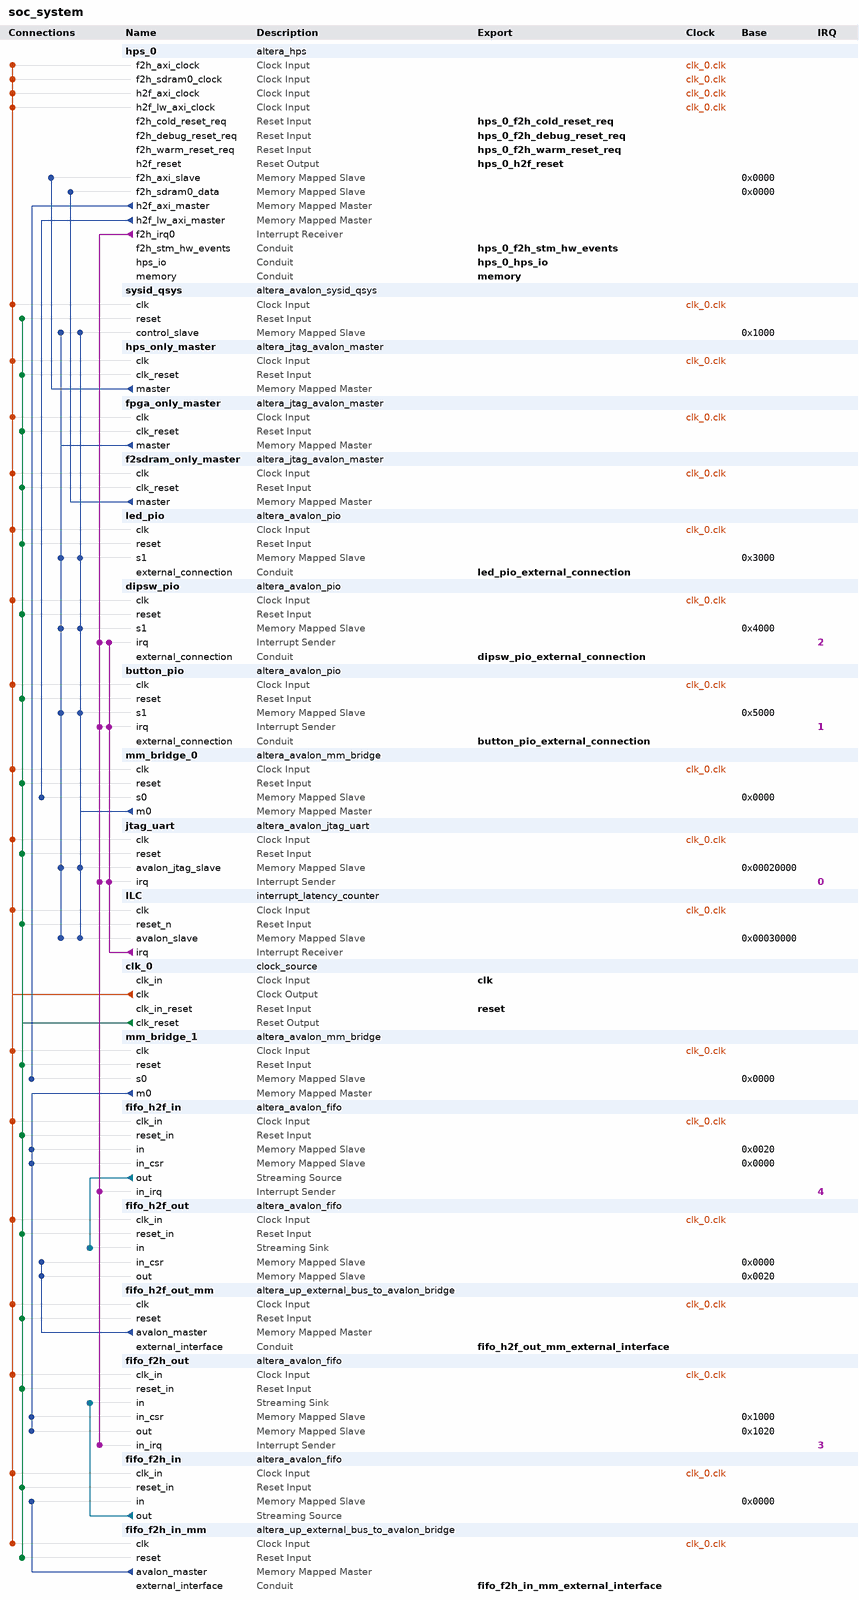
[diagram p0: system contents]
# Platform Designer (Qsys) system soc_system, Cyclone V 5CSXFC6D6F31C6
# Parameters at their usual value, and those the tool derives, are not listed.
package require -exact qsys 18.1
create_system soc_system
set_project_property DEVICE_FAMILY {Cyclone V}
set_project_property DEVICE 5CSXFC6D6F31C6

add_instance hps_0 altera_hps 18.1
set_instance_parameter_value hps_0 EMAC1_Mode RGMII
set_instance_parameter_value hps_0 EMAC1_PinMuxing {HPS I/O Set 0}
set_instance_parameter_value hps_0 F2SCLK_COLDRST_Enable true
set_instance_parameter_value hps_0 F2SCLK_DBGRST_Enable true
set_instance_parameter_value hps_0 F2SCLK_WARMRST_Enable true
set_instance_parameter_value hps_0 F2SDRAM_Type {Avalon-MM Bidirectional}
set_instance_parameter_value hps_0 F2SDRAM_Width 256
set_instance_parameter_value hps_0 F2SINTERRUPT_Enable true
set_instance_parameter_value hps_0 F2S_Width 2
set_instance_parameter_value hps_0 FPGA_PERIPHERAL_OUTPUT_CLOCK_FREQ_EMAC0_GTX_CLK 100
set_instance_parameter_value hps_0 FPGA_PERIPHERAL_OUTPUT_CLOCK_FREQ_EMAC0_MD_CLK 100.0
set_instance_parameter_value hps_0 FPGA_PERIPHERAL_OUTPUT_CLOCK_FREQ_EMAC1_GTX_CLK 100
set_instance_parameter_value hps_0 FPGA_PERIPHERAL_OUTPUT_CLOCK_FREQ_EMAC1_MD_CLK 100.0
set_instance_parameter_value hps_0 HPS_PROTOCOL DDR3
set_instance_parameter_value hps_0 I2C0_Mode I2C
set_instance_parameter_value hps_0 I2C0_PinMuxing {HPS I/O Set 0}
set_instance_parameter_value hps_0 I2C1_Mode I2C
set_instance_parameter_value hps_0 I2C1_PinMuxing {HPS I/O Set 0}
set_instance_parameter_value hps_0 LWH2F_Enable true
set_instance_parameter_value hps_0 MEM_BANKADDR_WIDTH 3
set_instance_parameter_value hps_0 MEM_CLK_FREQ 400.0
set_instance_parameter_value hps_0 MEM_COL_ADDR_WIDTH 10
set_instance_parameter_value hps_0 MEM_DQ_WIDTH 32
set_instance_parameter_value hps_0 MEM_DRV_STR RZQ/6
set_instance_parameter_value hps_0 MEM_ROW_ADDR_WIDTH 15
set_instance_parameter_value hps_0 MEM_RTT_NOM RZQ/6
set_instance_parameter_value hps_0 MEM_RTT_WR {Dynamic ODT off}
set_instance_parameter_value hps_0 MEM_TCL 11
set_instance_parameter_value hps_0 MEM_TFAW_NS 45.0
set_instance_parameter_value hps_0 MEM_TRAS_NS 35.0
set_instance_parameter_value hps_0 MEM_TRCD_NS 13.75
set_instance_parameter_value hps_0 MEM_TRFC_NS 260.0
set_instance_parameter_value hps_0 MEM_TRP_NS 13.75
set_instance_parameter_value hps_0 MEM_VENDOR Micron
set_instance_parameter_value hps_0 MEM_WTCL 7
set_instance_parameter_value hps_0 QSPI_Mode {1 SS}
set_instance_parameter_value hps_0 QSPI_PinMuxing {HPS I/O Set 0}
set_instance_parameter_value hps_0 REF_CLK_FREQ 25.0
set_instance_parameter_value hps_0 S2FCLK_USER2CLK 5
set_instance_parameter_value hps_0 S2F_Width 2
set_instance_parameter_value hps_0 SDIO_Mode {4-bit Data}
set_instance_parameter_value hps_0 SDIO_PinMuxing {HPS I/O Set 0}
set_instance_parameter_value hps_0 SPIM0_Mode {Single Slave Select}
set_instance_parameter_value hps_0 SPIM0_PinMuxing {HPS I/O Set 0}
set_instance_parameter_value hps_0 SPIM1_Mode {Single Slave Select}
set_instance_parameter_value hps_0 SPIM1_PinMuxing {HPS I/O Set 0}
set_instance_parameter_value hps_0 STM_Enable true
set_instance_parameter_value hps_0 TIMING_BOARD_AC_SKEW 0.02
set_instance_parameter_value hps_0 TIMING_BOARD_AC_TO_CK_SKEW 0.01
set_instance_parameter_value hps_0 TIMING_BOARD_DQ_TO_DQS_SKEW 0.05
set_instance_parameter_value hps_0 TIMING_BOARD_MAX_CK_DELAY 0.03
set_instance_parameter_value hps_0 TIMING_BOARD_MAX_DQS_DELAY 0.02
set_instance_parameter_value hps_0 TIMING_BOARD_SKEW_BETWEEN_DQS 0.06
set_instance_parameter_value hps_0 TIMING_BOARD_SKEW_CKDQS_DIMM_MAX 0.12
set_instance_parameter_value hps_0 TIMING_BOARD_SKEW_CKDQS_DIMM_MIN 0.06
set_instance_parameter_value hps_0 TIMING_BOARD_SKEW_WITHIN_DQS 0.01
set_instance_parameter_value hps_0 TIMING_TDH 65
set_instance_parameter_value hps_0 TIMING_TDQSCK 255
set_instance_parameter_value hps_0 TIMING_TDQSQ 125
set_instance_parameter_value hps_0 TIMING_TDS 30
set_instance_parameter_value hps_0 TIMING_TIH 140
set_instance_parameter_value hps_0 TIMING_TIS 190
set_instance_parameter_value hps_0 TIMING_TQSH 0.4
set_instance_parameter_value hps_0 UART0_Mode {No Flow Control}
set_instance_parameter_value hps_0 UART0_PinMuxing {HPS I/O Set 0}
set_instance_parameter_value hps_0 USB1_Mode SDR
set_instance_parameter_value hps_0 USB1_PinMuxing {HPS I/O Set 0}
set_instance_parameter_value hps_0 desired_cfg_clk_mhz 100.0
set_instance_parameter_value hps_0 desired_qspi_clk_mhz 400.0

add_instance sysid_qsys altera_avalon_sysid_qsys 18.1
set_instance_parameter_value sysid_qsys id -1395322110

add_instance hps_only_master altera_jtag_avalon_master 18.1

add_instance fpga_only_master altera_jtag_avalon_master 18.1

add_instance f2sdram_only_master altera_jtag_avalon_master 18.1

add_instance led_pio altera_avalon_pio 18.1
set_instance_parameter_value led_pio direction Output
set_instance_parameter_value led_pio width 10

add_instance dipsw_pio altera_avalon_pio 18.1
set_instance_parameter_value dipsw_pio bitClearingEdgeCapReg true
set_instance_parameter_value dipsw_pio captureEdge true
set_instance_parameter_value dipsw_pio direction Input
set_instance_parameter_value dipsw_pio edgeType ANY
set_instance_parameter_value dipsw_pio generateIRQ true
set_instance_parameter_value dipsw_pio irqType EDGE
set_instance_parameter_value dipsw_pio width 10

add_instance button_pio altera_avalon_pio 18.1
set_instance_parameter_value button_pio bitClearingEdgeCapReg true
set_instance_parameter_value button_pio captureEdge true
set_instance_parameter_value button_pio direction Input
set_instance_parameter_value button_pio edgeType FALLING
set_instance_parameter_value button_pio generateIRQ true
set_instance_parameter_value button_pio irqType EDGE
set_instance_parameter_value button_pio width 4

add_instance mm_bridge_0 altera_avalon_mm_bridge 18.1
set_instance_parameter_value mm_bridge_0 ADDRESS_UNITS SYMBOLS
set_instance_parameter_value mm_bridge_0 ADDRESS_WIDTH 10
set_instance_parameter_value mm_bridge_0 DATA_WIDTH 32
set_instance_parameter_value mm_bridge_0 MAX_PENDING_RESPONSES 4
set_instance_parameter_value mm_bridge_0 USE_AUTO_ADDRESS_WIDTH 1

add_instance jtag_uart altera_avalon_jtag_uart 18.1
set_instance_parameter_value jtag_uart allowMultipleConnections true
set_instance_parameter_value jtag_uart simInteractiveOptions INTERACTIVE_ASCII_OUTPUT

add_instance ILC interrupt_latency_counter 18.1

add_instance clk_0 clock_source 18.1
set_instance_parameter_value clk_0 clockFrequency 50000000

add_instance mm_bridge_1 altera_avalon_mm_bridge 18.1
set_instance_parameter_value mm_bridge_1 ADDRESS_UNITS SYMBOLS
set_instance_parameter_value mm_bridge_1 ADDRESS_WIDTH 10
set_instance_parameter_value mm_bridge_1 DATA_WIDTH 32
set_instance_parameter_value mm_bridge_1 MAX_PENDING_RESPONSES 4
set_instance_parameter_value mm_bridge_1 USE_AUTO_ADDRESS_WIDTH 1

add_instance fifo_h2f_in altera_avalon_fifo 18.1
set_instance_parameter_value fifo_h2f_in bitsPerSymbol 8
set_instance_parameter_value fifo_h2f_in channelWidth 0
set_instance_parameter_value fifo_h2f_in errorWidth 0
set_instance_parameter_value fifo_h2f_in fifoDepth 512
set_instance_parameter_value fifo_h2f_in fifoInputInterfaceOptions AVALONMM_WRITE
set_instance_parameter_value fifo_h2f_in fifoOutputInterfaceOptions AVALONST_SOURCE
set_instance_parameter_value fifo_h2f_in singleClockMode true
set_instance_parameter_value fifo_h2f_in symbolsPerBeat 4
set_instance_parameter_value fifo_h2f_in useIRQ true
set_instance_parameter_value fifo_h2f_in usePacket true
set_instance_parameter_value fifo_h2f_in useReadControl false

add_instance fifo_h2f_out altera_avalon_fifo 18.1
set_instance_parameter_value fifo_h2f_out bitsPerSymbol 8
set_instance_parameter_value fifo_h2f_out channelWidth 0
set_instance_parameter_value fifo_h2f_out errorWidth 0
set_instance_parameter_value fifo_h2f_out fifoDepth 8
set_instance_parameter_value fifo_h2f_out fifoInputInterfaceOptions AVALONST_SINK
set_instance_parameter_value fifo_h2f_out fifoOutputInterfaceOptions AVALONMM_READ
set_instance_parameter_value fifo_h2f_out singleClockMode true
set_instance_parameter_value fifo_h2f_out symbolsPerBeat 4
set_instance_parameter_value fifo_h2f_out useIRQ false
set_instance_parameter_value fifo_h2f_out usePacket true
set_instance_parameter_value fifo_h2f_out useReadControl false

add_instance fifo_h2f_out_mm altera_up_external_bus_to_avalon_bridge 18.0
set_instance_parameter_value fifo_h2f_out_mm addr_size 64
set_instance_parameter_value fifo_h2f_out_mm addr_size_multiplier bytes
set_instance_parameter_value fifo_h2f_out_mm data_size 32

add_instance fifo_f2h_out altera_avalon_fifo 18.1
set_instance_parameter_value fifo_f2h_out bitsPerSymbol 8
set_instance_parameter_value fifo_f2h_out channelWidth 0
set_instance_parameter_value fifo_f2h_out errorWidth 0
set_instance_parameter_value fifo_f2h_out fifoDepth 512
set_instance_parameter_value fifo_f2h_out fifoInputInterfaceOptions AVALONST_SINK
set_instance_parameter_value fifo_f2h_out fifoOutputInterfaceOptions AVALONMM_READ
set_instance_parameter_value fifo_f2h_out singleClockMode true
set_instance_parameter_value fifo_f2h_out symbolsPerBeat 4
set_instance_parameter_value fifo_f2h_out useIRQ true
set_instance_parameter_value fifo_f2h_out usePacket true
set_instance_parameter_value fifo_f2h_out useReadControl false

add_instance fifo_f2h_in altera_avalon_fifo 18.1
set_instance_parameter_value fifo_f2h_in bitsPerSymbol 8
set_instance_parameter_value fifo_f2h_in channelWidth 0
set_instance_parameter_value fifo_f2h_in errorWidth 0
set_instance_parameter_value fifo_f2h_in fifoDepth 8
set_instance_parameter_value fifo_f2h_in fifoInputInterfaceOptions AVALONMM_WRITE
set_instance_parameter_value fifo_f2h_in fifoOutputInterfaceOptions AVALONST_SOURCE
set_instance_parameter_value fifo_f2h_in singleClockMode true
set_instance_parameter_value fifo_f2h_in symbolsPerBeat 4
set_instance_parameter_value fifo_f2h_in useIRQ false
set_instance_parameter_value fifo_f2h_in usePacket true
set_instance_parameter_value fifo_f2h_in useReadControl false
set_instance_parameter_value fifo_f2h_in useWriteControl false

add_instance fifo_f2h_in_mm altera_up_external_bus_to_avalon_bridge 18.0
set_instance_parameter_value fifo_f2h_in_mm addr_size 8
set_instance_parameter_value fifo_f2h_in_mm addr_size_multiplier bytes
set_instance_parameter_value fifo_f2h_in_mm data_size 32

# connections
add_connection clk_0.clk button_pio.clk clock
add_connection clk_0.clk dipsw_pio.clk clock
add_connection clk_0.clk f2sdram_only_master.clk clock
add_connection clk_0.clk fifo_f2h_in.clk_in clock
add_connection clk_0.clk fifo_f2h_in_mm.clk clock
add_connection clk_0.clk fifo_f2h_out.clk_in clock
add_connection clk_0.clk fifo_h2f_in.clk_in clock
add_connection clk_0.clk fifo_h2f_out.clk_in clock
add_connection clk_0.clk fifo_h2f_out_mm.clk clock
add_connection clk_0.clk fpga_only_master.clk clock
add_connection clk_0.clk hps_0.f2h_axi_clock clock
add_connection clk_0.clk hps_0.f2h_sdram0_clock clock
add_connection clk_0.clk hps_0.h2f_axi_clock clock
add_connection clk_0.clk hps_0.h2f_lw_axi_clock clock
add_connection clk_0.clk hps_only_master.clk clock
add_connection clk_0.clk ILC.clk clock
add_connection clk_0.clk jtag_uart.clk clock
add_connection clk_0.clk led_pio.clk clock
add_connection clk_0.clk mm_bridge_0.clk clock
add_connection clk_0.clk mm_bridge_1.clk clock
add_connection clk_0.clk sysid_qsys.clk clock
add_connection clk_0.clk_reset button_pio.reset reset
add_connection clk_0.clk_reset dipsw_pio.reset reset
add_connection clk_0.clk_reset f2sdram_only_master.clk_reset reset
add_connection clk_0.clk_reset fifo_f2h_in.reset_in reset
add_connection clk_0.clk_reset fifo_f2h_in_mm.reset reset
add_connection clk_0.clk_reset fifo_f2h_out.reset_in reset
add_connection clk_0.clk_reset fifo_h2f_in.reset_in reset
add_connection clk_0.clk_reset fifo_h2f_out.reset_in reset
add_connection clk_0.clk_reset fifo_h2f_out_mm.reset reset
add_connection clk_0.clk_reset fpga_only_master.clk_reset reset
add_connection clk_0.clk_reset hps_only_master.clk_reset reset
add_connection clk_0.clk_reset ILC.reset_n reset
add_connection clk_0.clk_reset jtag_uart.reset reset
add_connection clk_0.clk_reset led_pio.reset reset
add_connection clk_0.clk_reset mm_bridge_0.reset reset
add_connection clk_0.clk_reset mm_bridge_1.reset reset
add_connection clk_0.clk_reset sysid_qsys.reset reset
add_connection f2sdram_only_master.master hps_0.f2h_sdram0_data avalon
set_connection_parameter_value f2sdram_only_master.master/hps_0.f2h_sdram0_data baseAddress 0x0000
add_connection fifo_f2h_in_mm.avalon_master fifo_f2h_in.in avalon
set_connection_parameter_value fifo_f2h_in_mm.avalon_master/fifo_f2h_in.in baseAddress 0x0000
add_connection fifo_h2f_out_mm.avalon_master fifo_h2f_out.in_csr avalon
set_connection_parameter_value fifo_h2f_out_mm.avalon_master/fifo_h2f_out.in_csr baseAddress 0x0000
add_connection fifo_h2f_out_mm.avalon_master fifo_h2f_out.out avalon
set_connection_parameter_value fifo_h2f_out_mm.avalon_master/fifo_h2f_out.out baseAddress 0x0020
add_connection fpga_only_master.master button_pio.s1 avalon
set_connection_parameter_value fpga_only_master.master/button_pio.s1 baseAddress 0x5000
add_connection fpga_only_master.master dipsw_pio.s1 avalon
set_connection_parameter_value fpga_only_master.master/dipsw_pio.s1 baseAddress 0x4000
add_connection fpga_only_master.master ILC.avalon_slave avalon
set_connection_parameter_value fpga_only_master.master/ILC.avalon_slave baseAddress 0x00030000
add_connection fpga_only_master.master jtag_uart.avalon_jtag_slave avalon
set_connection_parameter_value fpga_only_master.master/jtag_uart.avalon_jtag_slave baseAddress 0x00020000
add_connection fpga_only_master.master led_pio.s1 avalon
set_connection_parameter_value fpga_only_master.master/led_pio.s1 baseAddress 0x3000
add_connection fpga_only_master.master sysid_qsys.control_slave avalon
set_connection_parameter_value fpga_only_master.master/sysid_qsys.control_slave baseAddress 0x1000
add_connection hps_0.h2f_axi_master mm_bridge_1.s0 avalon
set_connection_parameter_value hps_0.h2f_axi_master/mm_bridge_1.s0 baseAddress 0x0000
add_connection hps_0.h2f_lw_axi_master mm_bridge_0.s0 avalon
set_connection_parameter_value hps_0.h2f_lw_axi_master/mm_bridge_0.s0 baseAddress 0x0000
add_connection hps_only_master.master hps_0.f2h_axi_slave avalon
set_connection_parameter_value hps_only_master.master/hps_0.f2h_axi_slave baseAddress 0x0000
add_connection mm_bridge_0.m0 button_pio.s1 avalon
set_connection_parameter_value mm_bridge_0.m0/button_pio.s1 baseAddress 0x5000
add_connection mm_bridge_0.m0 dipsw_pio.s1 avalon
set_connection_parameter_value mm_bridge_0.m0/dipsw_pio.s1 baseAddress 0x4000
add_connection mm_bridge_0.m0 ILC.avalon_slave avalon
set_connection_parameter_value mm_bridge_0.m0/ILC.avalon_slave baseAddress 0x00030000
add_connection mm_bridge_0.m0 jtag_uart.avalon_jtag_slave avalon
set_connection_parameter_value mm_bridge_0.m0/jtag_uart.avalon_jtag_slave baseAddress 0x00020000
add_connection mm_bridge_0.m0 led_pio.s1 avalon
set_connection_parameter_value mm_bridge_0.m0/led_pio.s1 baseAddress 0x3000
add_connection mm_bridge_0.m0 sysid_qsys.control_slave avalon
set_connection_parameter_value mm_bridge_0.m0/sysid_qsys.control_slave baseAddress 0x1000
add_connection mm_bridge_1.m0 fifo_f2h_out.in_csr avalon
set_connection_parameter_value mm_bridge_1.m0/fifo_f2h_out.in_csr baseAddress 0x1000
add_connection mm_bridge_1.m0 fifo_f2h_out.out avalon
set_connection_parameter_value mm_bridge_1.m0/fifo_f2h_out.out baseAddress 0x1020
add_connection mm_bridge_1.m0 fifo_h2f_in.in avalon
set_connection_parameter_value mm_bridge_1.m0/fifo_h2f_in.in baseAddress 0x0020
add_connection mm_bridge_1.m0 fifo_h2f_in.in_csr avalon
set_connection_parameter_value mm_bridge_1.m0/fifo_h2f_in.in_csr baseAddress 0x0000
add_connection fifo_f2h_in.out fifo_f2h_out.in avalon_streaming
add_connection fifo_h2f_in.out fifo_h2f_out.in avalon_streaming
add_connection hps_0.f2h_irq0 button_pio.irq interrupt
set_connection_parameter_value hps_0.f2h_irq0/button_pio.irq irqNumber 1
add_connection hps_0.f2h_irq0 dipsw_pio.irq interrupt
set_connection_parameter_value hps_0.f2h_irq0/dipsw_pio.irq irqNumber 0
add_connection hps_0.f2h_irq0 fifo_f2h_out.in_irq interrupt
set_connection_parameter_value hps_0.f2h_irq0/fifo_f2h_out.in_irq irqNumber 3
add_connection hps_0.f2h_irq0 fifo_h2f_in.in_irq interrupt
set_connection_parameter_value hps_0.f2h_irq0/fifo_h2f_in.in_irq irqNumber 4
add_connection hps_0.f2h_irq0 jtag_uart.irq interrupt
set_connection_parameter_value hps_0.f2h_irq0/jtag_uart.irq irqNumber 2
add_connection ILC.irq button_pio.irq interrupt
set_connection_parameter_value ILC.irq/button_pio.irq irqNumber 1
add_connection ILC.irq dipsw_pio.irq interrupt
set_connection_parameter_value ILC.irq/dipsw_pio.irq irqNumber 2
add_connection ILC.irq jtag_uart.irq interrupt
set_connection_parameter_value ILC.irq/jtag_uart.irq irqNumber 0

# exported interfaces
add_interface button_pio_external_connection conduit end
set_interface_property button_pio_external_connection EXPORT_OF button_pio.external_connection
add_interface clk clock sink
set_interface_property clk EXPORT_OF clk_0.clk_in
add_interface dipsw_pio_external_connection conduit end
set_interface_property dipsw_pio_external_connection EXPORT_OF dipsw_pio.external_connection
add_interface fifo_f2h_in_mm_external_interface conduit end
set_interface_property fifo_f2h_in_mm_external_interface EXPORT_OF fifo_f2h_in_mm.external_interface
add_interface fifo_h2f_out_mm_external_interface conduit end
set_interface_property fifo_h2f_out_mm_external_interface EXPORT_OF fifo_h2f_out_mm.external_interface
add_interface hps_0_f2h_cold_reset_req reset sink
set_interface_property hps_0_f2h_cold_reset_req EXPORT_OF hps_0.f2h_cold_reset_req
add_interface hps_0_f2h_debug_reset_req reset sink
set_interface_property hps_0_f2h_debug_reset_req EXPORT_OF hps_0.f2h_debug_reset_req
add_interface hps_0_f2h_stm_hw_events conduit end
set_interface_property hps_0_f2h_stm_hw_events EXPORT_OF hps_0.f2h_stm_hw_events
add_interface hps_0_f2h_warm_reset_req reset sink
set_interface_property hps_0_f2h_warm_reset_req EXPORT_OF hps_0.f2h_warm_reset_req
add_interface hps_0_h2f_reset reset source
set_interface_property hps_0_h2f_reset EXPORT_OF hps_0.h2f_reset
add_interface hps_0_hps_io conduit end
set_interface_property hps_0_hps_io EXPORT_OF hps_0.hps_io
add_interface led_pio_external_connection conduit end
set_interface_property led_pio_external_connection EXPORT_OF led_pio.external_connection
add_interface memory conduit end
set_interface_property memory EXPORT_OF hps_0.memory
add_interface reset reset sink
set_interface_property reset EXPORT_OF clk_0.clk_in_reset

set_interconnect_requirement {$system} qsys_mm.clockCrossingAdapter HANDSHAKE
set_interconnect_requirement {$system} qsys_mm.maxAdditionalLatency 1

save_system soc_system.qsys
